# EAGLE design mp3player_v7_Laderegler_LTC4063_4050 (EAGLE 9.1.2)
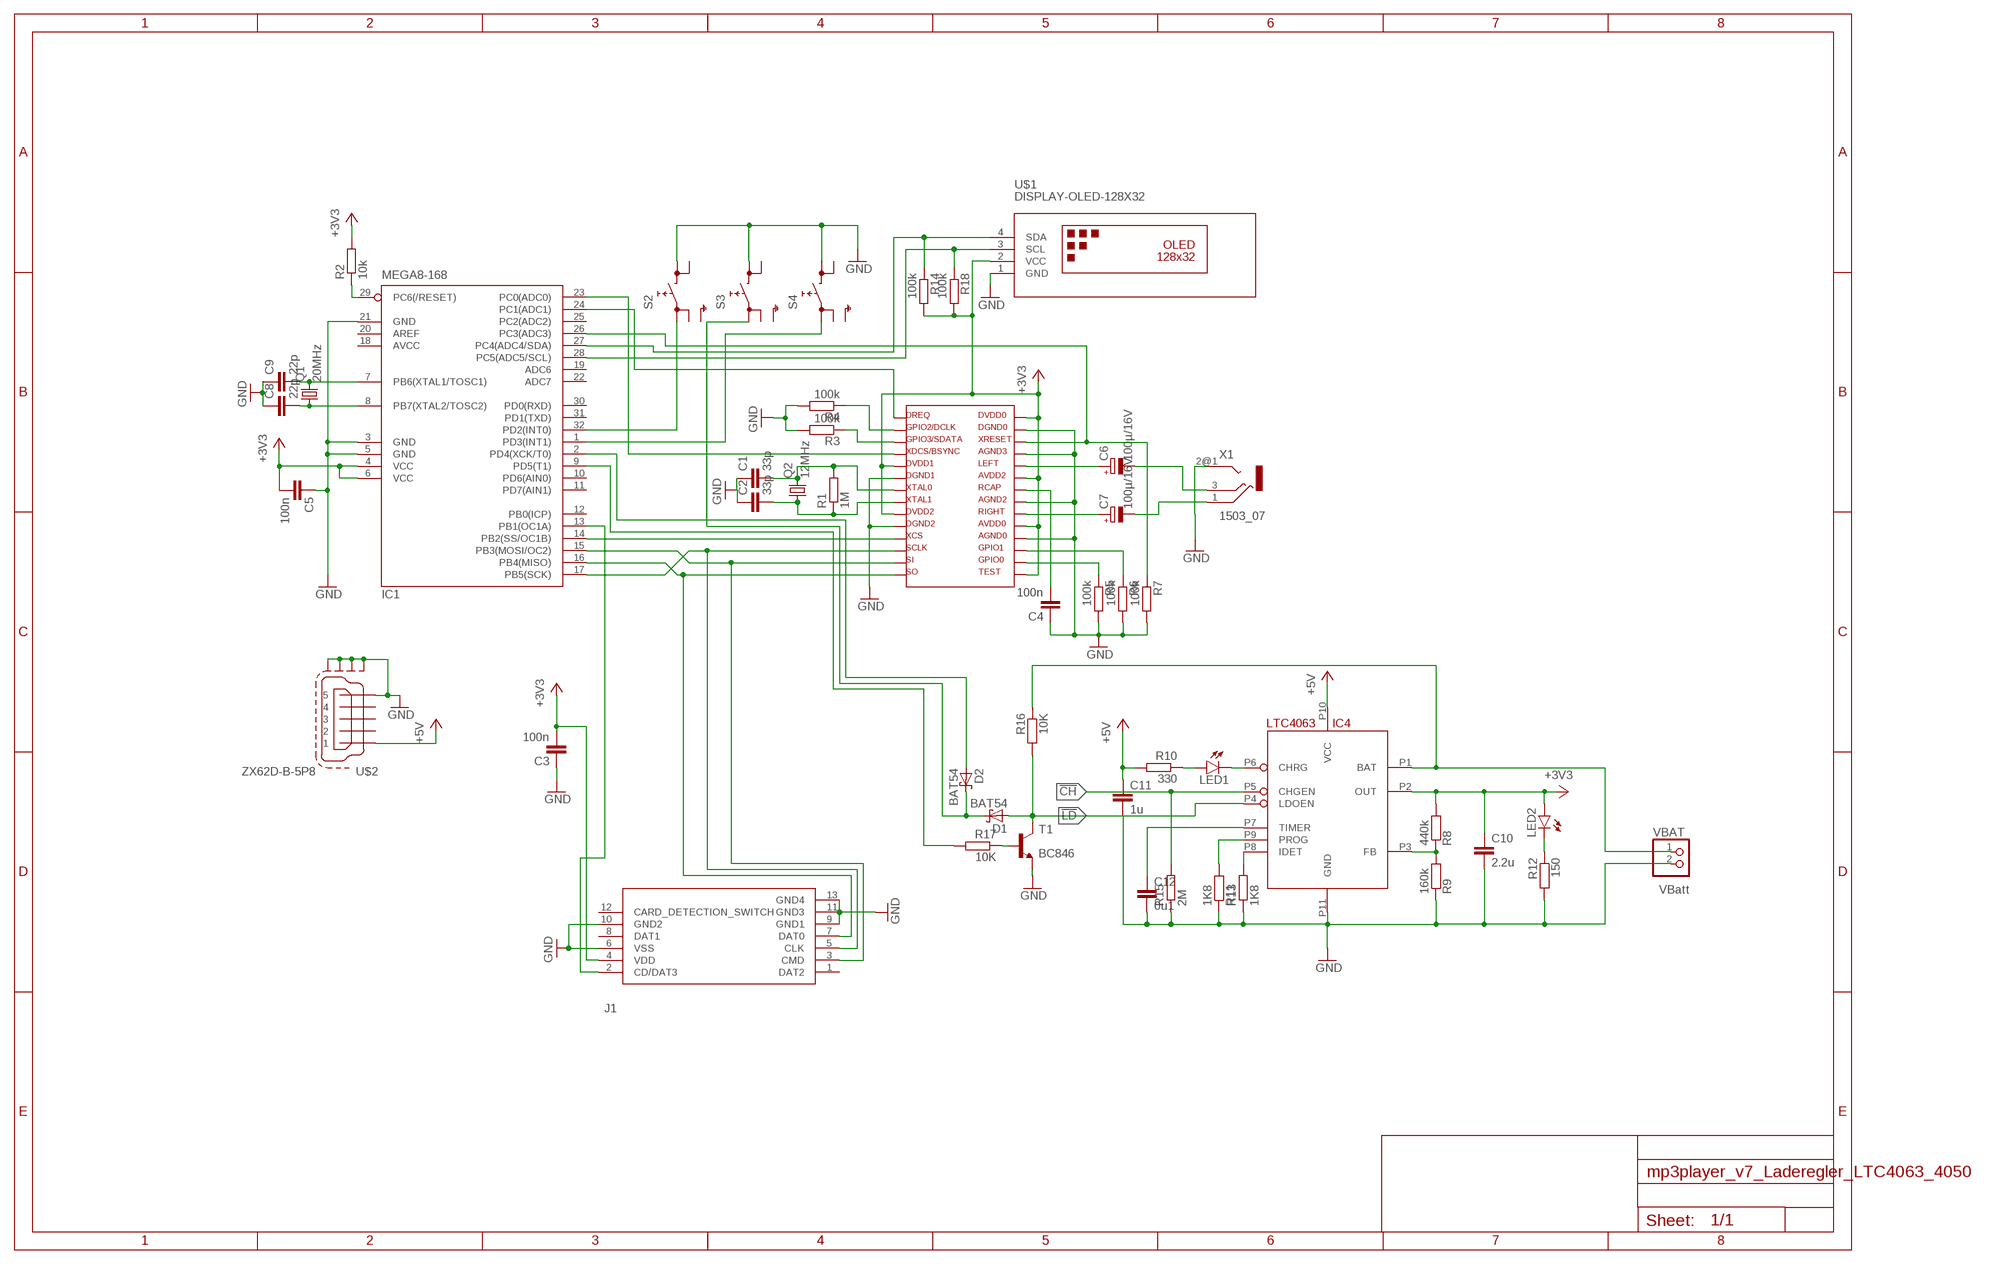
[diagram p0: schematic, sheet 1]

## Parts
C1  33p  C-EUC1206K  [C1206K]
C2  33p  C-EUC1206K  [C1206K]
C3  100n  C-EUC1206K  [C1206K]
C4  100n  C-EUC1206K  [C1206K]
C5  100n  C-EUC1206K  [C1206K]
C6  100µ/16V  CPOL-EUUD-6,3X7,7  [UD-6,3X7,7_NICHICON]
C7  100µ/16V  CPOL-EUUD-6,3X7,7  [UD-6,3X7,7_NICHICON]
C8  22p  C-EUC1206K  [C1206K]
C9  22p  C-EUC1206K  [C1206K]
C10  2.2u  C-EUC0805K  [C0805K]
C11  1u  C-EUC0805K  [C0805K]
C12  0u1  C-EUC0805K  [C0805K]
D1  BAT54  [SOT23]
D2  BAT54  [SOT23]
IC1  MEGA8-168  MEGA8-AI  [TQFP32-08]
IC2  VS1011  [SOIC-28]
IC4  LTC4063  [LTC4063]
J1  DM3CS-SF  [DM3CS-SF]
LED1  LG_T679-E1F1-1  [PLCC2]
LED2  LG_T679-E1F1-1  [PLCC2]
Q1  20MHz  CRYSTALHC49UP  [HC49UP]
Q2  12MHz  CRYSTALHC49UP  [HC49UP]
R1  1M  R-EU_R0805  [R0805]
R2  10k  R-EU_0207/7  [0207/7]
R3  100k  R-EU_R0805  [R0805]
R4  100k  R-EU_R0805  [R0805]
R5  100k  R-EU_R0805  [R0805]
R6  100k  R-EU_R0805  [R0805]
R7  100k  R-EU_0207/15  [0207/15]
R8  440k  R-EU_R0805  [R0805]
R9  160k  R-EU_R0805  [R0805]
R10  330  R-EU_R0805  [R0805]
R11  1K8  R-EU_R0805  [R0805]
R12  150  R-EU_R0805  [R0805]
R13  1K8  R-EU_R0805  [R0805]
R14  100k  R-EU_R0805  [R0805]
R15  2M  R-EU_R0805  [R0805]
R16  10K  R-EU_0207/7  [0207/7]
R17  10K  R-EU_R0805  [R0805]
R18  100k  R-EU_R0805  [R0805]
S2  SKHMPSE010  [SKHMPXE010]
S3  SKHMPSE010  [SKHMPXE010]
S4  SKHMPSE010  [SKHMPXE010]
T1  BC846  [SOT23]
U$1  DISPLAY-OLED-128X32  [DISPLAY-OLED-128X32]
U$2  ZX62D-B-5P8  [ZX62D-B-5P8]
VBAT  PINHD-1X2  [1X02]
X1  1503_07  [1503_07]

## Nets
!CH: IC4.P5(CHGEN) R15.2
!LD: D1.1(A) IC4.P4(LDOEN) R16.2 T1.3(C)
+3V3: C3.2 C5.2 C10.1 IC1.4(VCC) IC1.6(VCC) IC2.5 IC2.9 IC2.15 IC2.19 IC2.23 IC2.28 IC4.P2(OUT) J1.4(VDD) LED2.A R2.2 R8.2 R14.2 R18.2 U$1.2(VCC)
+5V: C11.1 IC4.P10(VCC) R10.2 U$2.P$1
GND: C1.1 C2.1 C3.1 C4.1 C5.1 C8.1 C9.1 C10.2 C11.2 C12.2 IC1.3(GND) IC1.5(GND) IC1.21(GND) IC2.6 IC2.10 IC2.18 IC2.21 IC2.25 IC2.27 IC4.P11(GND) J1.6(VSS) J1.9(GND1) J1.10(GND2) J1.11(GND3) J1.13(GND4) R3.2 R4.2 R5.2 R6.2 R7.2 R9.1 R11.1 R12.2 R13.1 R15.1 S2.3(2.1) S3.3(2.1) S4.3(2.1) T1.2(E) U$1.1(GND) U$2.P$5 U$2.SH1 U$2.SH2 U$2.SH3 U$2.SH4 VBAT.2 X1.2@1
N$1: IC1.17(PB5(SCK)) IC2.12 J1.5(CLK)
N$2: IC1.16(PB4(MISO)) IC2.14 J1.7(DAT0)
N$3: IC1.15(PB3(MOSI/OC2)) IC2.13 J1.3(CMD)
N$4: IC1.14(PB2(SS/OC1B)) IC2.11
N$6: C2.2 IC2.8 Q2.1 R1.1
N$7: IC1.23(PC0(ADC0)) IC2.4
N$8: C4.2 IC2.22
N$9: IC2.3 R3.1
N$10: C1.2 IC2.7 Q2.2 R1.2
N$11: IC2.2 R4.1
N$12: IC1.32(PD2(INT0)) S2.1(1.1)
N$13: IC2.17 R6.1
N$14: IC2.16 R5.1
N$15: IC1.24(PC1(ADC1)) IC2.1
N$16: D2.1(A) IC1.2(PD4(XCK/T0))
N$17: IC1.26(PC3(ADC3)) IC2.26 R7.1
N$18: IC1.29(PC6(/RESET)) R2.1
N$19: C7.+ IC2.20
N$20: C6.+ IC2.24
N$21: IC1.1(PD3(INT1)) S4.1(1.1)
N$22: C6.- X1.3
N$23: C7.- X1.1
N$24: C8.2 IC1.8(PB7(XTAL2/TOSC2)) Q1.1
N$25: C9.2 IC1.7(PB6(XTAL1/TOSC1)) Q1.2
N$28: IC4.P3(FB) R8.1 R9.2
N$33: IC4.P1(BAT) R16.1 VBAT.1
N$34: LED1.A R10.1
N$35: IC4.P9(PROG) R11.2
N$36: IC4.P6(CHRG) LED1.C
N$37: LED2.C R12.1
N$38: IC4.P8(IDET) R13.2
N$39: C12.1 IC4.P7(TIMER)
N$40: IC1.27(PC4(ADC4/SDA)) R14.1 U$1.4(SDA)
N$41: IC1.28(PC5(ADC5/SCL)) R18.1 U$1.3(SCL)
N$43: IC1.13(PB1(OC1A)) J1.2(CD/DAT3)
N$47: R17.1 T1.1(B)
N$49: IC1.9(PD5(T1)) R17.2
N$51: D1.3(C) D2.3(C) S3.1(1.1)
Unconnected: IC1.10(PD6(AIN0)) IC1.11(PD7(AIN1)) IC1.12(PB0(ICP)) IC1.19(ADC6) IC1.20(AREF) IC1.22(ADC7) IC1.25(PC2(ADC2)) IC1.30(PD0(RXD)) IC1.31(PD1(TXD)) J1.1(DAT2) J1.8(DAT1) J1.12(CARD_DETECTION_SWITCH) S2.2(1.2) S2.4(2.2) S2.5(SH) S3.2(1.2) S3.4(2.2) S3.5(SH) S4.2(1.2) S4.4(2.2) S4.5(SH) U$2.P$2 U$2.P$3 U$2.P$4 X1.2@2

## Notes on the sheet
- VBatt

## Power pins joined to a net without a drawn wire
AVCC: IC1.18(AVCC)

## Library data of the parts
C1-C5 C10-C12 = rcl:C-EU: CAPACITOR, European symbol
C6 C7 = rcl:CPOL-EU: POLARIZED CAPACITOR, European symbol
C8 C9 = rcl:C-EU: CAPACITOR, European symbol; SPICEPREFIX: C
D1 D2 = diode:BAT54: Schottky Diodes Source: Fairchild .. BAT54.pdf
IC1 = atmel:MEGA8: MICROCONTROLLER 8 Kbytes FLASH, 1 kbytes SRAM, 512 bytes EEPROM, USART, 6-channel 10 bit ADC, 2-channel 8 bit ADC Pin compatible with Atmega48, ATMega88, ATMega168 Source: avr.lbr; MPN: ATMEGA8-16AU; OC_FARNELL: 9171371; OC_NEWARK: 73M8863
IC2 = vs10xx:VS1011
IC4 = LinearTechnology:LTC4063: LTC4063 - Standalone Linear Li-Ion Charger with Micropower Low Dropout Linear Regulator The LTC®4063 is a standalone linear charger for single cell lithium-ion batteries with an adjustable low dropout linear regulator (LDO). The adjustable LDO regulates an output voltage between 1.2V to 4.2V at up to 100mA load cur- rent. When the input supply (wall adapter or USB supply) is removed, the LDO regulates the output voltage without interruption. The battery charger and LDO regulator can be enabled individually. No external sense resistor or external blocking diode is required for charging due to the internal MOSFET archi- tecture. For more details have a look at the data sheet <http://cds.linear.com/docs/en/datasheet/4063fc.pdf>. Copyright (c) 2013, Michael Hohl <http://www.michaelhohl.net>
J1 = SamacSys_Parts:DM3CS-SF: MicroSD card connector, push-pull type MicroSD card connector, push-pull type Source: Datasheet <http://docs-europe.electrocomponents.com/webdocs/118f/0900766b8118f8bb.pdf>; ARROW_PART_NUMBER: DM3CS-SF; ARROW_PRICE/STOCK: https://www.arrow.com/en/products/dm3cs-sf/hirose-electric; DESCRIPTION: MicroSD card connector, push-pull type MicroSD card connector, push-pull type; HEIGHT: mm; MANUFACTURER_NAME: Hirose; MANUFACTURER_PART_NUMBER: DM3CS-SF; RS_PART_NUMBER: 1664833; RS_PRICE/STOCK: http://uk.rs-online.com/web/p/products/1664833
LED1 LED2 = led:*_T679-?-1: LC TOPLED® Low Current LED Source: http://catalog.osram-os.com .. LG_LS_LY_T679_OBS.pdf; COLOR: green
Q1 = crystal:CRYSTAL: CRYSTAL; OC_FARNELL: unknown; OC_NEWARK: unknown
Q2 = crystal:CRYSTAL: CRYSTAL
R1-R10 R12-R18 = rcl:R-EU_: RESISTOR, European symbol; SPICEPREFIX: R
R11 = rcl:R-EU_: RESISTOR, European symbol
S2-S4 = switch:SKHMP*E010: 6.2 X 6.5mm TACT Switch (SMD) Source: http://www3.alps.co.jp/WebObjects/catalog.woa/PDF/E/Switch/Tact/SKHM/SKHM.PDF
T1 = transistor-neu-to92:BC846: NPN TRANSISTOR
U$1 = diy-modules:DISPLAY-OLED-128X32: 128x32 Dot Matrix OLED Module with I2C interface based on SSD1306 chip More details available here: http://www.tinyosshop.com/index.php?route=product/product&product_id=953 Schematic available here: http://www.tinyosshop.com/datasheet/OLED%2012832.pdf SSD1306 datasheet: https://cdn-shop.adafruit.com/datasheets/SSD1306.pdf Click here to find device on ebay.com <http://www.ebay.com/sch/oled+display+128x32+i2c>
U$2 = j_usb_hirose_zx62d-b-5p8:ZX62D-B-5P8: Hirose ZX62D-B-5P8 Micro-B USB connector, standard mount location, with through-hold shell tabs and SMD pins.
VBAT = pinhead:PINHD-1X2: PIN HEADER
X1 = con-lumberg:1503_?: Jack connectors according to JISC 6560, 3.5 mm Klinkensteckverbinder nach JISC 6560, 3,5 mm Source: http://www.lumberg.com/Produkte/PDFs/1503_08.pdf; OC_FARNELL: unknown; OC_NEWARK: unknown

## Board
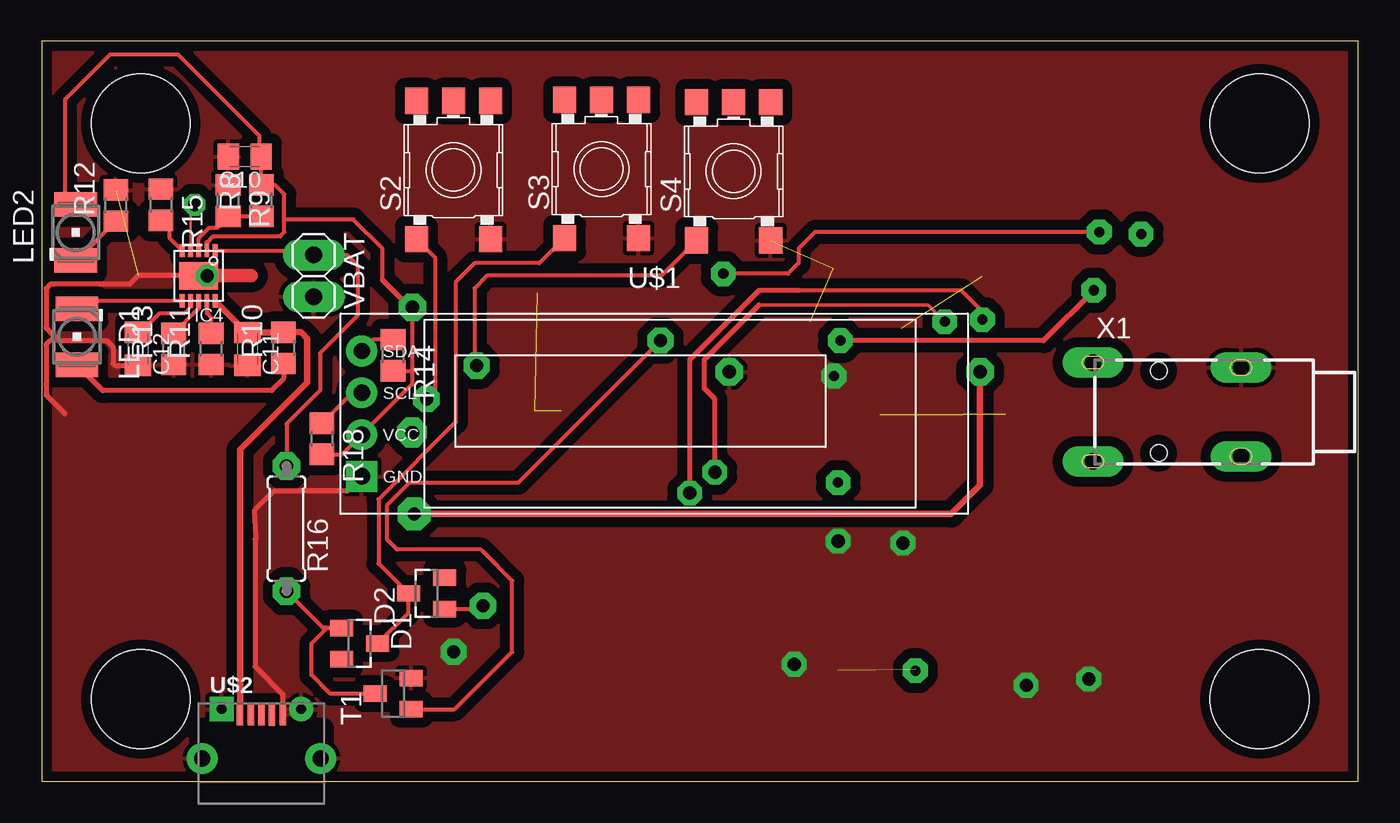
[diagram p1: board, top side]
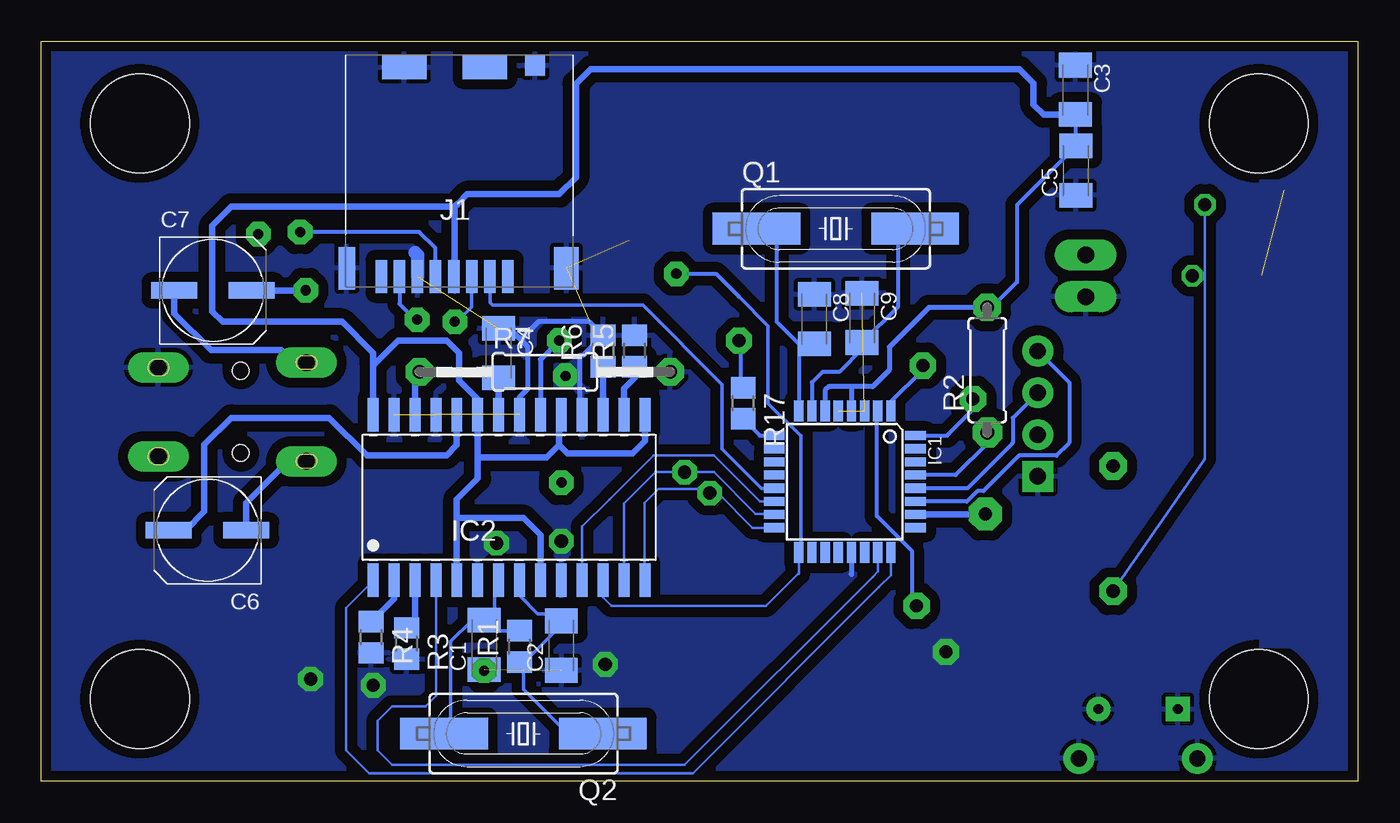
[diagram p2: board, bottom side, seen from below]

Size 80 x 45 mm. Coordinates in mm from the lower left corner, seen from the top.
Outline: 0,0 80,0 80,45 0,45 0,0
Copper layers (1*16): Top 0.035mm / dielectric 1.5mm / Bottom 0.035mm
Design rules "default *": minimum track width 5mil, minimum drill 24mil, track to track 5mil, track to pad 5mil, pad to pad 5mil, via to via 5mil, smd to smd 5mil, copper to edge 2mil, drill to drill 8mil, minimum pad ring 17mil, minimum via ring 8mil, stop-mask expansion 4mil, vias tented up to drill 0mil, thermal gap 10mil
Holes 6 mm at 6,40 74,40 74,5 6,5

### Footprints (pad centres in the part's own frame; a part is rotated, then mirrored left to right if it is on the bottom)
C1206K = smd 1.5 x 2: 1 -1.5,0; 2 1.5,0
UD-6,3X7,7_NICHICON = smd 2.8 x 1: + 2.35,0; - -2.35,0
C0805K = smd 1.3 x 1.6: 1 -1,0; 2 1,0
SOT23 = smd 1 x 1.4: 1 -0.95,-1.1; 2 0.95,-1.1; 3 0,1.1
TQFP32-08 = smd 1.27 x 0.559: 1 -4.293,2.8; 2 -4.293,2; 3 -4.293,1.2; 4 -4.293,0.4; 5 -4.293,-0.4; 6 -4.293,-1.2; 7 -4.293,-2; 8 -4.293,-2.8; 17 4.293,-2.8; 18 4.293,-2; 19 4.293,-1.2; 20 4.293,-0.4; 21 4.293,0.4; 22 4.293,1.2; 23 4.293,2; 24 4.293,2.8 | smd 0.559 x 1.27: 9 -2.8,-4.293; 10 -2,-4.293; 11 -1.2,-4.293; 12 -0.4,-4.293; 13 0.4,-4.293; 14 1.2,-4.293; 15 2,-4.293; 16 2.8,-4.293; 25 2.8,4.293; 26 2,4.293; 27 1.2,4.293; 28 0.4,4.293; 29 -0.4,4.293; 30 -1.2,4.293; 31 -2,4.293; 32 -2.8,4.293
SOIC-28 = smd 0.66 x 2.032: 1 -6.985,-5.029; 2 -5.715,-5.029; 3 -4.445,-5.029; 4 -3.175,-5.029; 5 -1.905,-5.029; 6 -0.635,-5.029; 7 0.635,-5.029; 8 1.905,-5.029; 9 3.175,-5.029; 10 4.445,-5.029; 11 5.715,-5.029; 12 6.985,-5.029; 13 8.255,-5.029; 14 9.525,-5.029; 15 9.525,5.029; 16 8.255,5.029; 17 6.985,5.029; 18 5.715,5.029; 19 4.445,5.029; 20 3.175,5.029; 21 1.905,5.029; 22 0.635,5.029; 23 -0.635,5.029; 24 -1.905,5.029; 25 -3.175,5.029; 26 -4.445,5.029; 27 -5.715,5.029; 28 -6.985,5.029
LTC4063 = smd 0.3 x 0.8: P1 -1,-1.525; P2 -0.5,-1.525; P3 0,-1.525; P4 0.5,-1.525; P5 1,-1.525; P6 1,1.525; P7 0.5,1.525; P8 0,1.525; P9 -0.5,1.525; P10 -1,1.525 | smd 2.38 x 1.65: P11 0,0
DM3CS-SF = smd 0.7 x 2: 1 0,0; 2 -1.1,0; 3 -2.2,0; 4 -3.3,0; 5 -4.4,0; 6 -5.5,0; 7 -6.6,0; 8 -7.7,0 | smd 1 x 2.6: 9 -9.8,0.5 | smd 1.5 x 2.6: 10 3.55,0.5 | smd 1.2 x 1.2: 11 1.65,12.8 | smd 2.7 x 1.4: 12 -1.4,12.7; 13 -6.3,12.7
PLCC2 = smd 2.6 x 1.5: A 0,1.7; C 0,-1.7
HC49UP = smd 5.334 x 1.93: 1 -4.826,0; 2 4.826,0
R0805 = smd 1.3 x 1.5: 1 -0.95,0; 2 0.95,0
0207/7 = drill 0.813 octagon: 1 -3.81,0; 2 3.81,0
0207/15 = drill 0.813 octagon: 1 -7.62,0; 2 7.62,0
SKHMPXE010 = smd 1.6 x 1.4: 1 -4.2,2.25; 2 4.2,2.25; 3 -4.2,-2.25; 4 4.2,-2.25; 5 4.2,0
DISPLAY-OLED-128X32 = drill 1 square: 1 -17.78,-3.81 | drill 1: 2 -17.78,-1.27; 3 -17.78,1.27; 4 -17.78,3.81
ZX62D-B-5P8 = smd 0.4 x 1.35: P$1 -1.3,2.675; P$2 -0.65,2.675; P$3 0,2.675; P$4 0.65,2.675; P$5 1.3,2.675 | drill 0.6 pad 1 square: SH1 -2.425,3 | drill 0.6 pad 1: SH2 2.425,3 | drill 1 pad 1.4: SH3 -3.6,0; SH4 3.6,0
1X02 = drill 1.016 long: 1 -1.27,0; 2 1.27,0
1503_07 = drill 1 pad 1.2 long: 1 -3,-11; 2@1 -2.7,-2; 2@2 2.7,-2; 3 3,-11 | hole 1: -2.5,-7; 2.5,-7

### Placement (x,y rotation side)
C1  53.07,8.3 90 bottom
C2  48.39,8.26 90 bottom
C3  17.14,42.04 270 bottom
C4  52.2,26.04 270 bottom
C5  17.12,37.12 90 bottom
C6  69.89,15.27 180 bottom
C7  69.56,29.85 0 bottom
C8  33.01,28.1 270 bottom
C9  30.11,28.17 270 bottom
C10  12.32,37.97 180 top
C11  12.49,26.29 270 top
C12  5.84,26.29 270 top
D1  19.3,8.38 270 top
D2  23.37,11.43 90 top
IC1  31.16,18.22 270 bottom
IC2  52.83,17.27 0 bottom
IC4  9.52,30.73 180 top
J1  51.63,30.69 0 bottom
LED1  2.13,27.02 180 top
LED2  2.05,33.37 0 top
Q1  31.71,33.6 0 bottom
Q2  50.69,2.91 180 bottom
R1  50.93,8.21 90 bottom
R2  22.5,25 90 bottom
R3  57.78,8.38 270 bottom
R4  59.94,8.76 270 bottom
R5  43.94,26.16 90 bottom
R6  45.85,26.16 90 bottom
R7  49.39,24.9 0 bottom
R8  13.33,35.31 90 top
R9  11.32,35.31 270 top
R10  14.68,26.35 90 top
R11  10.29,26.29 90 top
R12  4.49,35.01 90 top
R13  8,26.29 90 top
R14  21.34,25.91 270 top
R15  7.24,35.05 270 top
R16  14.86,15.37 270 top
R17  37.34,22.99 270 bottom
R18  17.02,20.83 270 top
S2  25.01,37.16 90 top
S3  34.01,37.23 90 top
S4  42.04,37.08 90 top
T1  21.34,5.33 90 top
U$1  37.21,22.35 0 top
U$2  13.33,1.4 0 top
VBAT  16.52,30.73 270 top
X1  74.87,22.46 270 top

### Tracks (layer width: path | path; a pad name or v marks a point on that pad's centre or on a via)
!CH
  Top 0.152: IC4.P5 8.51,32.26 | 7.75,33.78 7.43,34.1 R15.2
  Top 0.254: IC4.P5 7.75,33.04 7.75,33.78
!LD  (via drill 0.8 pad 1.3)
  Top 0.152: IC4.P4 9.02,34.42 9.27,34.67 v9.27,35.05
  Top 0.254: R16.2 17.08,9.33 D1.1 17.33,9.33 16.38,8.38 16.38,6.48 17.53,5.33 T1.3
  Bottom 0.152: v9.27,35.05 9.27,19.61 R16.2
+3V3
  Top 0.152: IC4.P2 | 14.04,36.26 R8.2 | 1.91,35.22 LED2.A | 13.33,37.96 C10.1
  Top 0.254: 10.02,32.76 10.41,33.15 14.48,33.15 14.73,33.4 14.73,34.16 | 14.73,34.16 14.73,35.69 14.16,36.26 R8.2 13.33,37.96 | 13.21,38.08 13.21,39.24 8.26,44.19 4.15,44.19 1.43,41.47 1.43,35.7 LED2.A | 22.5,24.89 R2.2 22.37,28.81 | 22.5,24.89 22.5,24.15 U$1.2 18.23,19.88 R18.2 | 20.7,30.48 20.7,32.38 18.92,34.16 14.73,34.16 | R14.2 22.43,24.96 22.5,24.89
  Top 0.305: IC4.P2 10.02,32.76 | 22.37,28.81 20.7,30.48
  Top 1.016: 13.21,38.08 13.33,37.96
  Bottom 0.127: 54.86,30.76 J1.4
  Bottom 0.152: 54.86,29.72 54.86,30.76
  Bottom 0.254: R2.2 22.24,28.81 20.7,30.35 20.7,35.04 C5.2 17.14,38.65 C3.2 | 30.73,24 30.76,23.98
  Bottom 0.305: R2.2 26.05,28.81 28.45,26.42 28.45,25.02 29.46,24 30.73,24 32.13,24 32.36,23.78 IC1.6 | 30.76,23.98 IC1.4
  Bottom 0.406: IC2.5 54.74,16 | 54.74,16 54.74,17.14 53.47,18.41 53.47,19.68 | 53.47,19.68 IC2.23 53.47,23.24 54.61,24.38 54.61,26.04 55.24,26.67 55.37,26.8 58.29,26.8 59.82,25.27 | 53.47,19.68 49.28,19.68 48.51,20.45 | 48.51,20.45 48.51,22.17 IC2.19 | IC2.15 43.31,20.7 44.07,19.94 48.01,19.94 48.51,20.45 | IC2.9 49.66,14.99 50.67,16 54.74,16 | 59.82,25.27 IC2.28 | 59.82,25.27 59.82,26.04 61.72,27.94 68.96,27.94 69.6,28.57 69.6,33.78 68.45,34.92 54.86,34.92 | 54.67,35.12 54.1,35.69 48.51,35.69 47.5,36.7 47.5,42.42 46.61,43.31 20.55,43.31 19.69,42.44 19.69,41.15 19.07,40.54 C3.2 | 54.67,35.12 54.86,34.92 | 54.86,34.92 54.86,30.76 | 54.86,34.92 54.67,35.12
+5V
  Top 0.152: 12.45,27.29 C11.1 | 14.66,27.29 R10.2
  Top 0.406: IC4.P10 12.45,27.29 | C11.1 14.66,27.29 | R10.2 15.75,27.3 16.13,26.92 16.13,24.26 12.04,20.16 U$2.P$1
GND  (via drill 0.61 pad 1.5, 0.8 pad 1.5, 0.8 pad 1.6)  (9 unrouted)
  Top 0.152: 4.54,36 R12.2
  Top 0.305: U$2.P$5 14.63,5.3 12.95,6.99 12.95,14.73 13.01,14.79 12.94,16.49 14.1,17.65 18.54,17.65 U$1.1 | IC4.P11 5.84,30.73 5.33,30.23 0.51,30.23 0.25,29.97 0.25,27.56 0.76,27.05 | 0.76,27.05 1.02,26.8 3.94,26.8 4.32,26.42 4.32,25.4 4.43,25.29 C12.2 | 0.76,27.05 0.25,26.54 0.25,24.13 0.25,23.5 1.4,22.35
  Bottom 0.305: IC2.21 50.93,23.37 50.42,23.88 50.42,26.42 50.74,26.73 | C4.1 51.54,27.54 50.74,26.73 | IC2.18 47.24,22.3 47.24,25.91 47.05,25.91 R6.2 46.67,27.94 49.78,27.94 50.74,26.99 50.74,26.73 | IC1.21 30.76,12.6 30.73,12.57
  Bottom 0.813: J1.6 57.13,31.98 57.28,32.13
  other vias: 45.72,7.11 59.82,5.84 63.63,6.22 52.32,14.48 48.39,14.61 25.02,7.87 48.13,24.64
  pour Bottom: 2.41,36.58 2.41,8.13 5.97,8.13 5.97,36.58
  pour Top: 79.12,8.64 76.07,8.64 76.07,37.08 79.12,37.08
  pour Top (isolate 0.61): 0,0 80.01,0 80.01,44.96 0,44.96
  pour Bottom (isolate 0.61): 0,0 80.01,0 80.01,44.83 0,44.83
N$1  (via drill 0.61 pad 1.5)
  Top 0.254: v64.26,33.4 46.99,33.4 45.97,32.38 45.97,31.5 45.34,30.86 v41.4,30.86
  Bottom 0.152: IC2.12 45.85,11.18 45.34,10.67 35.94,10.67 33.97,12.64 33.96,12.62 IC1.17
  Bottom 0.203: IC1.17 33.83,14.05 33.83,21.04 33.84,21.02 35.81,22.99 35.81,27.69 37.59,29.46
  Bottom 0.254: J1.5 56.03,32.41 57.02,33.4 v64.26,33.4 64.39,33.27 | v41.4,30.86 38.99,30.86 37.59,29.46
N$2  (via drill 0.61 pad 1.5, 0.8 pad 1.5)
  Top 0.254: v57.15,28.07 57.15,28.57 55.88,29.84 45.97,29.84
  Top 0.305: v39.37,17.53 39.37,25.65 43.56,29.84 45.97,29.84
  Bottom 0.127: 58.29,30.76 J1.7
  Bottom 0.152: IC2.14 43.33,12.26 43.33,16.94 42.49,17.78 39.88,17.78 | IC1.16 36.76,15.42 38.86,17.53 v39.37,17.53
  Bottom 0.203: v39.37,17.53 39.62,17.53 39.88,17.78
  Bottom 0.254: J1.7 58.23,29.02 57.15,27.94 v57.15,28.07
N$3  (via drill 0.61 pad 1.5, 0.8 pad 1.5)
  Top 0.203: v54.86,27.94 53.85,28.96 43.56,28.96
  Top 0.305: v40.89,18.8 40.89,23.24 40.26,23.88 40.26,25.65 43.56,28.96
  Bottom 0.127: 53.85,30.71 J1.3
  Bottom 0.152: 44.45,12.37 IC2.13 44.58,16.89 42.67,18.8 41.54,18.8 | v40.89,18.8 39.12,18.8 36.58,16.26 35.48,16.26 IC1.15 | 54.74,27.94 v54.86,27.94
  Bottom 0.203: 41.54,18.8 v40.89,18.8 | J1.3 53.83,28.85 54.74,27.94
N$4
  Bottom 0.152: IC1.14 36.32,17.02 39.12,19.81 42.8,19.81 45.47,17.14 47.12,15.49 IC2.11
N$5  (via drill 0.35)
  other vias: 5.97,40.01
N$6
  Bottom 0.203: Q2.1 47.99,2.9 50.67,5.59 50.67,7 R1.1 50.63,7.26 48.39,9.5 C2.2 48.39,9.91 48.68,10.2 49.82,10.2 50.93,11.3 IC2.8
N$7
  Bottom 0.152: IC2.4 56.01,5.21 56.64,4.57 58.67,4.57 59.56,3.68 59.56,1.91 58.67,1.02 40.89,1.02 29.46,12.45 29.16,12.75 IC1.23
N$8
  Bottom 0.406: C4.2 IC2.22
N$9
  Bottom 0.406: IC2.3 57.28,9.84 R3.1
N$10
  Bottom 0.152: 52.96,9.91 C1.2
  Bottom 0.203: R1.2 52.2,9.16 52.96,9.91 | IC2.7 52.45,11.99 52.45,10.04 52.69,9.8 C1.2 53.82,9.8 55.12,8.51 55.12,3.3 Q2.2
N$11
  Bottom 0.406: IC2.2 58.55,11.11 R4.1
N$12  (via drill 0.8 pad 1.6)
  Top 0.254: S2.1 23.88,31.84 23.88,23.75 v23.37,23.24
  Bottom 0.254: v23.37,23.24 23.37,22.61 24.83,21.14 24.89,21.08 24.95,21.02 IC1.32
N$13
  Bottom 0.406: R6.1 IC2.17
N$14
  Bottom 0.406: R5.1 43.94,24.51 44.58,23.88 IC2.16
N$15
  Bottom 0.152: IC1.24 28.36,12.54 29.08,11.81 40.39,0.51 60.07,0.51 61.47,1.91 61.47,10.54 59.82,12.19 IC2.1
N$16  (via drill 0.8 pad 1.6)
  Top 0.254: D2.1 26.61,10.48 v26.8,10.67
  Bottom 0.254: 26.86,10.73 v26.8,10.67 27.05,10.92 27.05,13.97 29.21,16.13 29.21,22.46 IC1.2
N$17  (via drill 0.8 pad 2)
  Top 0.406: R7.1 57.01,18.02 55.24,16.26 v22.61,16.26
  Bottom 0.406: R7.1 57.28,24.59 IC2.26 | v22.61,16.26 22.64,16.22 IC1.26
N$18
  Bottom 0.254: R2.1 22.5,20.55 24.43,18.62 IC1.29
N$19  (via drill 0.61 pad 1.5)
  Top 0.305: v63.92,29.85 60.87,26.8 v48.51,26.8
  Bottom 0.305: v48.51,26.8 49.66,25.65 IC2.20
  Bottom 0.406: v63.91,29.84 v63.92,29.85 C7.+
N$20
  Bottom 0.406: IC2.24 54.74,20.45 55.37,19.81 60.2,19.81 62.48,22.1 68.45,22.1 70.08,20.47 70.08,16.41 71.22,15.27 C6.+
N$21  (via drill 0.8 pad 1.6)
  Top 0.254: S4.1 37.64,30.73 27.05,30.73 26.29,29.97 26.29,25.65 26.42,25.53 v26.42,25.27
  Bottom 0.254: v26.42,25.27 26.42,25.02 28.36,23.08 IC1.1
N$22
  Bottom 0.406: C6.- 67.54,16.94 65.02,19.46 X1.3
N$23
  Bottom 0.406: C7.- 71.91,28.45 69.68,26.22 65.4,26.22 64.77,25.59 64,25.59 X1.1
N$24
  Bottom 0.152: 33.97,26.6 C8.2
  Bottom 0.254: C8.2 33.96,26.6 IC1.8 | Q1.1 35.9,33.6 35.31,33.01 35.31,27.94 33.97,26.6
N$25
  Bottom 0.152: 27.94,32.92 27.26,33.6 Q1.2
  Bottom 0.254: IC1.7 33.16,24.25 32.51,24.89 31.5,24.89 30.11,26.28 C9.2 27.94,28.84 27.94,32.92
N$26
  Top 0.813: 10.54,30.73 12.7,30.73
N$27  (via drill 0.61 pad 1.5)
  other vias: 48.39,18.16
N$28
  Top 0.152: IC4.P3 9.52,32.56 | R8.1 | 11.32,34.3 R9.2
  Top 0.254: R9.2 R8.1 | IC4.P3 9.52,33.02 10.16,33.66 10.67,33.66 11.32,34.3
N$29  (via drill 0.61 pad 1.5)
  other vias: 53.09,6.73
N$30  (via drill 0.61 pad 1.5)
  other vias: 66.8,33.27
N$33
  Top 0.152: VBAT.1
  Top 0.254: IC4.P1 16.26,32.26 VBAT.1 | VBAT.1 18.54,32 19.18,31.37 19.18,28.32 16.89,26.04 16.89,23.75 14.86,21.72 R16.1
N$34
  Top 0.305: R10.1 14.68,24.46 13.97,23.75 3.7,23.75 LED1.A
N$35
  Top 0.254: R11.2 10.29,28.19 10.02,28.46 IC4.P9
N$36
  Top 0.152: 2.61,29.21 LED1.C
  Top 0.254: IC4.P6 2.61,29.21
N$37
  Top 0.152: LED2.C 2.11,31.67
  Top 0.254: 2.11,31.67 R12.1
N$38
  Top 0.152: 9.52,28.76 IC4.P8
  Top 0.254: R13.2 9.52,28.76
N$39
  Top 0.152: 9.02,28.84 IC4.P7 | C12.1 5.97,27.29
  Top 0.203: 8.64,28.45 9.02,28.84
  Top 0.254: 5.97,27.29 7.13,28.45 8.64,28.45
N$40
  Top 0.254: R14.1 20.13,26.86 U$1.4
  Bottom 0.254: IC1.27 23.75,17.02 23.11,17.65 22.73,17.65 20.57,19.81 18.29,19.81 17.53,20.57 17.53,24.26 U$1.4
N$41
  Top 0.254: R18.1 18.86,23.62 U$1.3
  Bottom 0.254: U$1.3 20.96,22.1 20.96,20.57 23.71,17.82 IC1.28
N$42  (via drill 0.8 pad 1.8)
  other vias: 22.48,21.21
N$43
  Bottom 0.127: 52.83,30.79 J1.2
  Bottom 0.2: 36.24,17.82 38.61,20.19 38.61,24.13 43.43,28.96
  Bottom 0.203: IC1.13 36.24,17.82 | J1.2 52.73,29.11 52.58,28.96 43.43,28.96
N$44  (via drill 0.35)
  other vias: 74,40.01
N$45  (via drill 0.35)
  other vias: 74,5
N$46  (via drill 0.35)
  other vias: 5.98,4.99
N$47  (via drill 0.8 pad 1.6)
  Top 0.254: T1.1 25.09,4.38 28.58,7.87 28.58,12.19 26.86,13.91 26.67,14.1 21.59,14.1 20.96,14.73 20.96,16.76 22.35,18.16 28.96,18.16 v37.59,26.8
  Bottom 0.254: R17.1 37.46,24.06 37.46,26.8 v37.59,26.8
N$48  (via drill 0.8 pad 1.3)
  other vias: 10.03,30.73
N$49
  Bottom 0.254: R17.2 36.32,21.02 IC1.9
N$51
  Top 0.254: S3.1 30.23,31.5 26.29,31.5 25.15,30.35 25.15,21.84 20.45,17.14 20.45,13.25 D2.3 22.27,10.25 D1.3

### Text on the board
tNames: HTL-Saalfelden | MP3-Player
tRestrict: MP3 HTL Saalfelden
bRestrict: MP3 HTL Saalfelden